# EasyEDA Pro project USB_C_BREADBOARD_PD.eprj, board PCB1
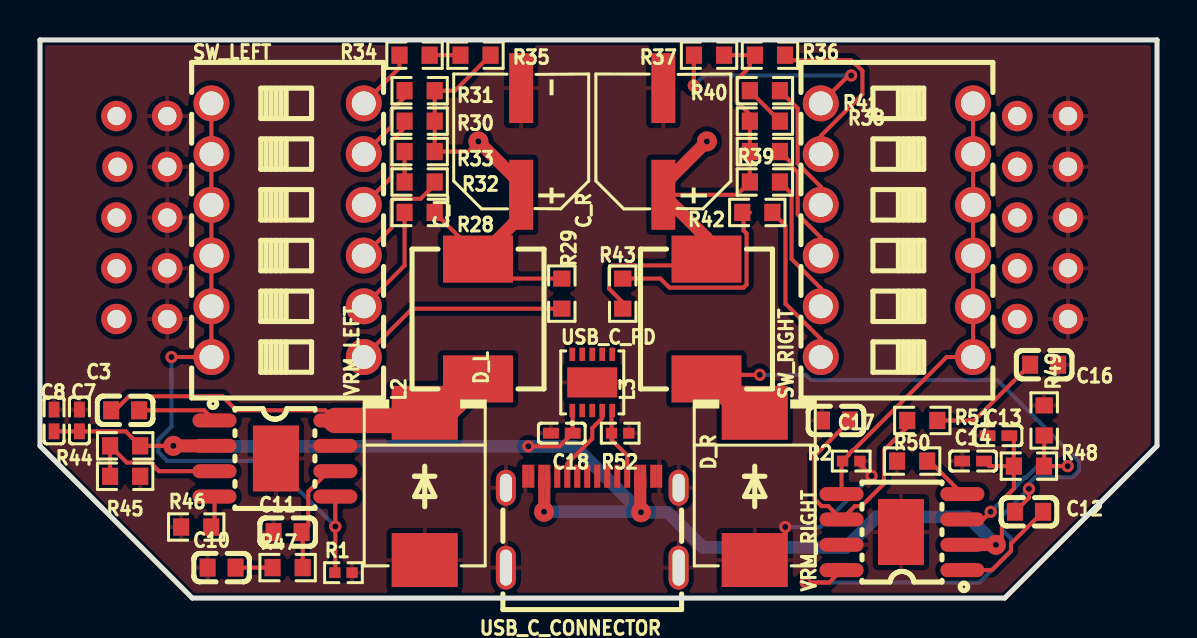
[diagram p4: board, top side]
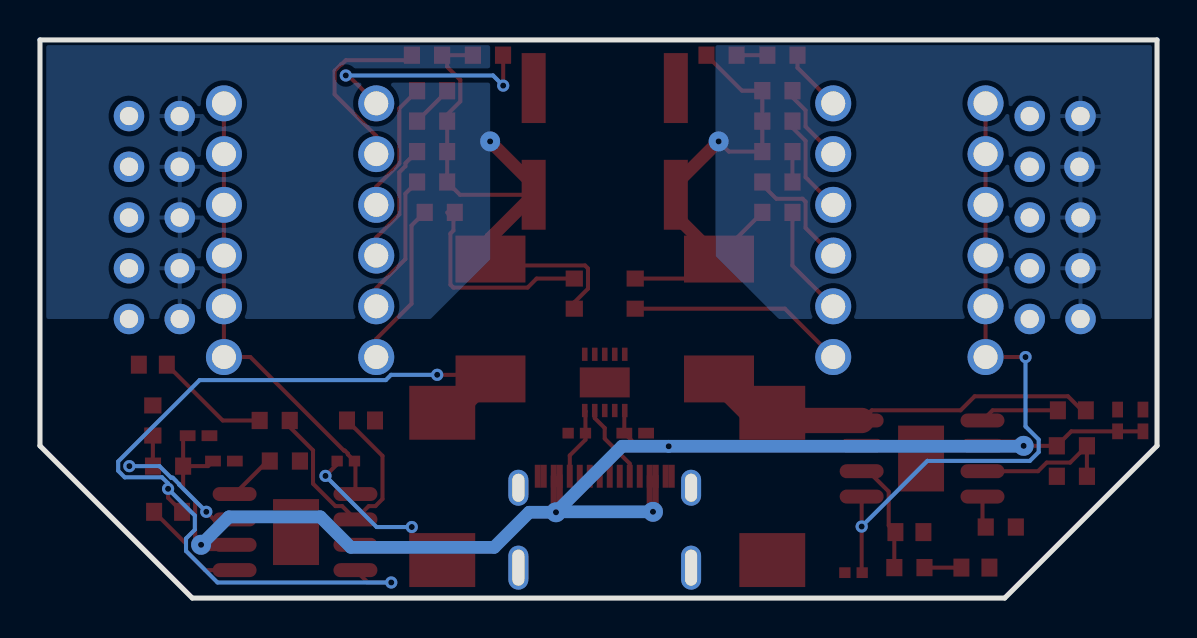
[diagram p5: board, bottom side, seen from below]

Outline 55.88 x 27.94 mm; copper layers: Top Layer, Bottom Layer. Coordinates in mm from the lower left corner of the outline.
Outline path: 0,27.94 55.88,27.94 55.88,7.62 48.26,0 7.62,0 0,7.62 0,27.94
Stack: Top Layer 0.035mm / Dielectric1 1.51mm FR4 er 4.5 / Bottom Layer 0.035mm

## Design rules (mm)
template: JLCPCB Capability(Two Layers Board)
spacing copperThickness1oz (default): track to track 0.102, other pairs 0.152 to 0.3
spacing copperThickness2oz: track to track 0.203, other pairs 0.152 to 0.3
track width copperThickness1oz (default): min 0.127, default 0.254, max 2.54
track width copperThickness2oz: min 0.203, default 0.254, max 2.54
differential pair differentialPair (default): width min 0.127, default 0.254, max 2.54; gap min 0.152, default 0.152
via viaSize (default): diameter min 0.5, default 0.61, max 10; hole min 0.3, default 0.305, max 6.3

## Placement (name value [footprint] x y rotation side)
C3  100nF  [C0603]  4.26 9.4 180 top
C7  2.2uF  [C0402]  1.97 8.89 90 top
C8  2.2uF  [C0402]  0.7 8.89 90 top
C10  680pF  [C0603]  9.09 1.52 0 top
C11  100pF  [C0603]  12.39 3.3 0 top
C12  100nF  [C0603]  49.47 4.32 180 top
C13  2.2uF  [C0402]  47.95 8.13 180 top
C14  2.2uF  [C0402]  46.68 6.86 180 top
C16  680pF  [C0603]  50.23 11.68 180 top
C17  100pF  [C0603]  39.82 8.89 0 top
C18  1uF  [C0402]  26.1 8.25 180 top
C_L  100uF  [CAP-SMD_BD6.3-L6.6-W6.6-LS7.6-FD]  24.07 22.86 90 top
C_R  100uF  [CAP-SMD_BD6.3-L6.6-W6.6-LS7.6-FD]  31.18 22.86 90 top
D_L  B560C  [SMC_L6.9-W5.9-LS7.9-RD]  19.25 5.59 270 top
D_R  B560C  [SMC_L6.9-W5.9-LS7.9-RD]  35.76 5.59 270 top
L2  10uH  [IND-SMD_L7.3-W6.8]  21.91 13.97 90 top
L3  10uH  [IND-SMD_L7.3-W6.8]  33.34 13.97 90 top
NOREF  -  [Pad_e95]  6.37 16.51 0 top
NOREF#2  -  [Pad_e75]  51.43 24.13 0 top
NOREF#3  -  [Pad_e76]  48.89 24.13 0 top
NOREF#4  -  [Pad_e100]  3.83 24.13 0 top
NOREF#5  -  [Pad_e61]  51.43 16.51 0 top
NOREF#6  -  [Pad_e82]  48.89 13.97 0 top
NOREF#7  -  [Pad_e58]  48.89 19.05 0 top
NOREF#8  -  [Pad_e99]  6.37 24.13 0 top
NOREF#9  -  [Pad_e55]  51.43 19.05 0 top
NOREF#10  -  [Pad_e62]  48.89 16.51 0 top
NOREF#11  -  [Pad_e81]  51.43 13.97 0 top
NOREF#12  -  [Pad_e94]  3.83 19.05 0 top
NOREF#13  -  [Pad_e93]  6.37 19.05 0 top
NOREF#14  -  [Pad_e65]  51.43 21.59 0 top
NOREF#15  -  [Pad_e102]  3.83 13.97 0 top
NOREF#16  -  [Pad_e98]  3.88 21.59 0 top
NOREF#17  -  [Pad_e66]  48.89 21.59 0 top
NOREF#18  -  [Pad_e97]  6.37 21.59 0 top
NOREF#19  -  [Pad_e96]  3.83 16.51 0 top
NOREF#20  -  [Pad_e101]  6.37 13.97 0 top
R1  10.2kΩ  [R0402]  15.18 1.27 0 top
R2  10.2kΩ  [R0402]  40.58 6.86 0 top
R28  53.6kΩ  [R0603]  18.99 19.3 180 top
R29  31.6kΩ  [R0603]  26.1 15.24 270 top
R30  105kΩ  [R0603]  18.99 23.88 180 top
R31  182kΩ  [R0603]  18.99 25.4 180 top
R32  82kΩ  [R0603]  18.99 20.83 0 top
R33  3.3kΩ  [R0603]  18.99 22.35 180 top
R34  243kΩ  [R0603]  18.74 27.18 0 top
R35  1.8kΩ  [R0603]  21.79 27.18 180 top
R36  53.6kΩ  [R0603]  36.52 27.18 0 top
R37  31.6kΩ  [R0603]  33.47 27.18 180 top
R38  105kΩ  [R0603]  36.26 22.35 0 top
R39  182kΩ  [R0603]  36.26 20.83 0 top
R40  82kΩ  [R0603]  36.26 25.4 0 top
R41  3.3kΩ  [R0603]  36.26 23.88 0 top
R42  243kΩ  [R0603]  35.88 19.3 180 top
R43  1.8kΩ  [R0603]  29.15 15.24 90 top
R44  365kΩ  [R0603]  4.26 7.62 0 top
R45  86.6kΩ  [R0603]  4.26 6.1 180 top
R46  162kΩ  [R0603]  7.82 3.56 0 top
R47  10kΩ  [R0603]  12.39 1.52 0 top
R48  365kΩ  [R0603]  49.47 6.6 180 top
R49  86.6kΩ  [R0603]  50.23 8.89 270 top
R50  162kΩ  [R0603]  43.63 6.86 0 top
R51  10kΩ  [R0603]  44.14 8.89 180 top
R52  1kΩ  [R0402]  29.02 8.25 180 top
SW_LEFT  DSWB06LHGET  [SW-TH_DSWB06LHGET]  12.39 18.41 270 top
SW_RIGHT  DSWB06LHGET  [SW-TH_DSWB06LHGET]  42.87 18.41 90 top
USB_C_CONNECTOR  UKIBATCCA  [USB-C-SMD_UKIBATCCA]  27.63 3.81 0 top
USB_C_PD  HUSB238_002DD  [DFN-10_L3.0-W3.0-P0.50-BL-EP2.5]  27.63 10.8 0 top
VRM_LEFT  TPS54340DDAR  [SOIC-8_L4.9-W3.9-P1.27-LS6.0-BL-EP3.3]  11.75 6.98 270 top
VRM_RIGHT  TPS54340DDAR  [SOIC-8_L4.9-W3.9-P1.27-LS6.0-BL-EP3.3]  43.12 3.3 90 top

## Footprints (pads in the part's own frame, mm; a bottom-side part is the same pattern mirrored in y, then rotated)
C0402
  rect 0.79x0.54 smd: 1(-0.545,0) 2(0.545,0)
C0603
  rect 0.8x0.9 smd: 1(-0.7,0) 2(0.7,0)
CAP-SMD_BD6.3-L6.6-W6.6-LS7.6-FD
  rect 3.5x1.2 smd: 1(-2.67,0) 2(2.67,0)
DFN-10_L3.0-W3.0-P0.50-BL-EP2.5
  rect 0.28x0.665 smd: 1(-1,-1.407) 2(-0.5,-1.407) 3(0,-1.407) 4(0.5,-1.407) 5(1,-1.407) 6(1,1.407) 7(0.5,1.407) 8(0,1.407) 9(-0.5,1.407) 10(-1,1.407)
  rect 2.5x1.5 smd: 11(0,0)
IND-SMD_L7.3-W6.8
  rect 2.35x3.5 smd: 1(-3,0) 2(3,0)
Pad_e55
  round 1.524 hole 0.914: 1(0,0)
Pad_e58
  round 1.524 hole 0.914: 2(0,0)
Pad_e61
  round 1.524 hole 0.914: 1(0,0)
Pad_e62
  round 1.524 hole 0.914: 2(0,0)
Pad_e65
  round 1.524 hole 0.914: 1(0,0)
Pad_e66
  round 1.524 hole 0.914: 2(0,0)
Pad_e75
  round 1.524 hole 0.914: 1(0,0)
Pad_e76
  round 1.524 hole 0.914: 2(0,0)
Pad_e81
  round 1.524 hole 0.914: 1(0,0)
Pad_e82
  round 1.524 hole 0.914: 2(0,0)
Pad_e93
  round 1.524 hole 0.914: 1(0,0)
Pad_e94
  round 1.524 hole 0.914: 2(0,0)
Pad_e95
  round 1.524 hole 0.914: 1(0,0)
Pad_e96
  round 1.524 hole 0.914: 2(0,0)
Pad_e97
  round 1.524 hole 0.914: 1(0,0)
Pad_e98
  round 1.524 hole 0.914: 2(0,0)
Pad_e99
  round 1.524 hole 0.914: 1(0,0)
Pad_e100
  round 1.524 hole 0.914: 2(0,0)
Pad_e101
  round 1.524 hole 0.914: 1(0,0)
Pad_e102
  round 1.524 hole 0.914: 2(0,0)
R0402
  rect 0.566x0.54 smd: 1(-0.433,0) 2(0.433,0)
R0603
  rect 0.806x0.864 smd: 1(-0.753,0) 2(0.753,0)
SMC_L6.9-W5.9-LS7.9-RD
  rect 2.7x3.3 smd: 1(-3.687,0) 2(3.687,0)
SOIC-8_L4.9-W3.9-P1.27-LS6.0-BL-EP3.3
  oval 0.7x2.2 smd: 1(-1.905,-3.022) 2(-0.635,-3.022) 3(0.635,-3.022) 4(1.905,-3.022) 5(1.905,3.022) 6(0.635,3.022) 7(-0.635,3.022) 8(-1.905,3.022)
  rect 3.3x2.3 smd: 9(0,0.051)
SW-TH_DSWB06LHGET
  round 1.8 hole 1.2: 1(-6.35,3.81) 2(-3.81,3.81) 3(-1.27,3.81) 4(1.27,3.81) 5(3.81,3.81) 6(6.35,3.81) 7(-6.35,-3.81) 8(-3.81,-3.81) 9(-1.27,-3.81) 10(1.27,-3.81) 11(3.81,-3.81) 12(6.35,-3.81)
USB-C-SMD_UKIBATCCA
  oval 1x1.8 hole 0.6x1.4: 1(-4.32,1.712) 2(4.32,1.712)
  oval 1x2.2 hole 0.6x1.8: 3(4.32,-2.288) 4(-4.32,-2.288)
  rect 0.3x1.15 smd: A1(-3.35,2.288) A4(-2.55,2.288) A5(-1.25,2.288) A6(-0.25,2.288) A7(0.25,2.288) A8(1.25,2.288) A9(2.55,2.288) A12(3.35,2.288) B1(3.05,2.288) B4(2.25,2.288) B5(1.75,2.288) B6(0.75,2.288) B7(-0.75,2.288) B8(-1.75,2.288) B9(-2.25,2.288) B12(-3.05,2.288)

## Nets
As in the schematic, except:
GND: C7.2 C8.2 C10.1 C11.1 C13.2 C14.2 C16.1 C17.1 C18.2 C_L.2 C_R.2 D_L.2 D_R.2 NOREF.1 NOREF#2.1 NOREF#5.1 NOREF#8.1 NOREF#9.1 NOREF#11.1 NOREF#13.1 NOREF#14.1 NOREF#18.1 NOREF#20.1 R1.2 R2.2 R45.1 R46.1 R49.1 R50.1 R52.1 USB_C_CONNECTOR.1 USB_C_CONNECTOR.2 USB_C_CONNECTOR.3 USB_C_CONNECTOR.4 USB_C_CONNECTOR.A1 USB_C_CONNECTOR.A12 USB_C_CONNECTOR.B1 USB_C_CONNECTOR.B12 USB_C_PD.11 VRM_LEFT.7 VRM_LEFT.9 VRM_RIGHT.7 VRM_RIGHT.9
VOUT_L: C_L.1 L2.2 NOREF#4.2 NOREF#12.2 NOREF#15.2 NOREF#16.2 NOREF#19.2 R28.1 R29.1 R30.1 R31.1 R33.1 R35.1
VOUT_R: C_R.1 L3.2 NOREF#3.2 NOREF#6.2 NOREF#7.2 NOREF#10.2 NOREF#17.2 R36.1 R37.1 R38.1 R39.1 R41.1 R43.1

Pads without a net: USB_C_CONNECTOR A6 A7 A8 B6 B7 B8; USB_C_PD 2 3 6 7 8 9 10

## Via types
v1: diameter 0.61, hole 0.305, Top Layer to Bottom Layer, 12 vias
v2: diameter 1, hole 0.305, Top Layer to Bottom Layer, 6 vias

## Routing (per net, layer and track width the routed paths; a pad name or vN(x,y) marks a point on that pad's centre or on a via; arc(x,y) is an arc through that point)
GND: length 9.1
  Top Layer w0.203: v1(37.28,3.56) 37.28,2.79 35.88,1.39 ; R2.2 41.02,6.7 v1(41.6,6.11)
  Bottom Layer w0.203: v1(37.28,3.56) 39.04,3.56 v1(41.6,6.11)
VBUS: length 77.9
  Top Layer w0.203: C14.1 47.48,6.6 R48.2 ; C13.1 48.72,7.9 R48.2 ; USB_C_PD.1 26.65,9.37 C18.1 25.99,7.6 v1(24.43,7.6) ; R48.2 48.72,5.47 48.12,4.87 48.12,2.96 v2(47.82,2.67) ; C8.1 C7.1 4.29,8.34 R44.2 v2(6.67,7.62)
  Top Layer w0.305: USB_C_CONNECTOR.A4 25.08,4.45 v2(25.21,4.32) 25.38,4.48 USB_C_CONNECTOR.B9 ; USB_C_CONNECTOR.B4 29.88,4.48 v2(30.07,4.29) 30.18,4.41 USB_C_CONNECTOR.A9
  Top Layer w0.635: VRM_LEFT.2 v2(6.67,7.62) ; v2(47.82,2.67) 46.14,2.67
  Bottom Layer w0.635: v2(25.21,4.32) 30.04,4.32 ; 30.04,4.32 v2(30.07,4.29) 31.4,4.29 33.16,2.54 40.33,2.54 41.85,4.06 46.42,4.06 v2(47.82,2.67) ; 30.04,4.32 26.76,7.6 v1(24.43,7.6) 6.7,7.6 v2(6.67,7.62)
CC1: length 4
  Top Layer w0.203: USB_C_PD.4 28.13,9.01 27.63,8.51 27.63,7.98 26.38,6.73 USB_C_CONNECTOR.A5
CC2: length 3.6
  Top Layer w0.203: USB_C_CONNECTOR.B5 29.38,7.14 28.59,7.93 R52.2 28.59,9.35 USB_C_PD.5
FB_L: length 34
  Top Layer w0.203: v1(6.58,12.06) SW_LEFT.12 SW_LEFT.11 SW_LEFT.10 SW_LEFT.9 SW_LEFT.8 SW_LEFT.7 ; R1.1 14.78,1.3 v1(14.78,3.58) VRM_LEFT.5
  Bottom Layer w0.203: v1(14.78,3.58) 11.49,6.87 6.36,6.87 5.92,7.31 5.92,7.93 6.58,8.59 v1(6.58,12.06)
FB_R: length 23.1
  Top Layer w0.203: SW_RIGHT.12 SW_RIGHT.11 SW_RIGHT.10 SW_RIGHT.9 SW_RIGHT.8 SW_RIGHT.7 45.36,12.06 40.67,7.38 40.63,7.38 40.48,7.23 40.48,7.19 R2.1 40.1,6.81 VRM_RIGHT.5
VOUT_L: length 24.5
  Top Layer w0.203: R28.1 21.91,17.14 L2.2 22.89,15.99 R29.1 ; R35.1 20.76,25.4 R31.1 R30.1 R33.1 21.42,22.35 v2(21.93,22.86)
  Top Layer w0.635: L2.2 24.07,19.13 C_L.1 24.07,20.72 v2(21.93,22.86)
VOUT_R: length 28.2
  Top Layer w0.203: C_R.1 34.87,20.19 R39.1 R38.1 R41.1 35.51,24.21 34.85,24.86 34.85,25.94 35.51,26.59 35.51,26.92 R36.1 R37.1 ; R43.1 29.15,14.8 28.47,15.48 28.47,16.5 28.61,16.65 33.02,16.65 L3.2
  Top Layer w0.635: L3.2 33.34,18.03 C_R.1 31.18,20.68 v2(33.36,22.86)
$1N5740: length 4
  Top Layer w0.203: VRM_LEFT.1 8.22,9.4 C3.1
$1N5745: length 20.1
  Top Layer w0.203: C3.2 3.75,9.4 4.45,10.1 9.12,10.1 9.83,9.4 14.27,9.4 VRM_LEFT.8
  Top Layer w1.27: L2.1 19.71,8.77 19.37,8.77 19.25,8.89 VRM_LEFT.8
$1N6296: length 10.9
  Top Layer w0.203: R29.2 18.62,14.49 SW_LEFT.6
$1N6449: length 5.5
  Top Layer w0.203: R28.2 18.24,16.65 SW_LEFT.5
$1N6649: length 5
  Top Layer w0.203: SW_LEFT.3 17.58,21.07 17.58,22.89 18.24,23.55 R30.2
$1N6653: length 4
  Top Layer w0.203: SW_LEFT.2 17.58,23.61 17.58,24.41 18.24,25.07 R31.2
$1N6699: length 5.9
  Top Layer w0.203: SW_LEFT.4 17.58,18.53 17.58,19.84 17.73,19.99 19.04,19.99 19.75,20.69 R32.2
$1N6739: length 1.5
  Top Layer w0.203: R32.1 R33.2
$1N6813: length 3.2
  Top Layer w0.203: SW_LEFT.1 17.98,26.55 R34.1
$1N6887: length 1.5
  Top Layer w0.203: R34.2 R35.2
$1N7317: length 11.7
  Top Layer w0.203: v1(32.71,25.65) 32.71,27.17 R37.2 ; v1(40.58,26.16) 40.45,26.16 SW_RIGHT.6
  Bottom Layer w0.203: v1(40.58,26.16) 33.22,26.16 v1(32.71,25.65)
$1N7320: length 9.2
  Top Layer w0.203: SW_RIGHT.5 39.06,23.13 41.14,25.22 41.14,26.39 40.81,26.72 40.79,26.72 40.58,26.92 37.53,26.92 R36.2
$1N7323: length 6.1
  Top Layer w0.203: SW_RIGHT.3 39.06,18.05 37.9,19.21 37.9,21.32 37.6,21.62 37.6,21.77 R38.2
$1N7326: length 7.1
  Top Layer w0.203: R39.2 37.6,20.25 37.6,16.97 39.06,15.51 SW_RIGHT.2
$1N7329: length 6.6
  Top Layer w0.203: R40.2 37.9,24.51 37.9,21.75 39.06,20.59 SW_RIGHT.4
$1N7332: length 2.1
  Top Layer w0.203: R41.2 35.51,25.38 R40.1
$1N7334: length 8.2
  Top Layer w0.203: R42.1 37.29,18.65 37.29,14.74 39.06,12.97 SW_RIGHT.1
$1N7336: length 10.2
  Top Layer w0.203: 35.51,19.3 35.2,18.99 35.2,18.4 35.35,18.25 35.35,15.69 35.2,15.54 31.49,15.54 31.04,15.99 R43.2
$1N7988: length 7.3
  Top Layer w0.203: VRM_LEFT.3 5.95,6.35 5.52,6.78 4.34,6.78 R44.1 R45.2
$1N8112: length 1.6
  Top Layer w0.203: R46.2 8.73,3.72 VRM_LEFT.4
$1N8250: length 5.7
  Top Layer w0.203: R47.2 13.14,3.25 C11.2 13.42,3.64 13.42,5.33 14.44,6.35 VRM_LEFT.6
$1N8288: length 1.8
  Top Layer w0.203: R47.1 C10.2
$1N9971: length 5.5
  Top Layer w0.203: VRM_RIGHT.1 47.62,1.4 48.57,2.35 48.57,2.72 C12.1
$1N9972: length 45.1
  Top Layer w0.203: v1(38.31,0.78) 39.48,0.78 VRM_RIGHT.8 ; v1(36.01,11.18) 33.68,11.18 ; v1(49.47,5.47) 49.47,5.02 C12.2
  Top Layer w1.27: 33.68,10.97 35.88,8.77 ; L3.1 33.47,10.97
  Bottom Layer w0.203: v1(38.31,0.78) 47,0.78 48.57,2.35 48.57,2.98 48.13,3.42 48.13,4.13 v1(49.47,5.47) 49.47,5.74 49.78,6.05 51.64,6.05 51.97,6.37 51.97,6.84 47.89,10.91 38.58,10.91 38.32,11.18 v1(36.01,11.18)
$1N9979: length 9.1
  Top Layer w0.203: 50.23,6.61 50.24,6.6 v1(51.41,6.6) ; 50.23,6.61 R49.2 ; 50.23,6.61 R48.1 ; VRM_RIGHT.3 47.18,3.94 v1(47.56,4.32)
  Bottom Layer w0.203: v1(51.41,6.6) 49.9,6.6 49.33,6.03 49.24,6.03 48.91,5.7 48.91,5.67 v1(47.56,4.32)
$1N9980: length 2.4
  Top Layer w0.203: R50.2 44.49,6.86 VRM_RIGHT.4
$1N9981: length 13
  Top Layer w0.203: C17.2 38.75,7.12 38.75,4.96 39.1,4.6 39.43,4.6 VRM_RIGHT.6 40.77,4.6 41.1,4.6 42.22,5.72 42.22,7.39 43.38,8.56 R51.2
$1N9982: length 5.8
  Top Layer w0.203: C16.2 46.74,8.89 R51.1

## Copper pours and planes (outline as drawn; the poured copper is in the pictures)
GND on Top Layer: -0.31,27.94 55.57,27.94 55.57,7.62 47.95,0 7.31,0 -0.31,7.62
VOUT_L on Bottom Layer: 22.09,27.94 22.09,17.15 18.91,13.97 -0.32,13.97 0,27.94
VOUT_R on Bottom Layer: 55.82,27.94 33.36,27.94 33.36,16.99 33.34,16.97 36.34,13.97 55.82,13.97
